# Altium project 2021-10-03-First_PCB_Project.PrjPcb
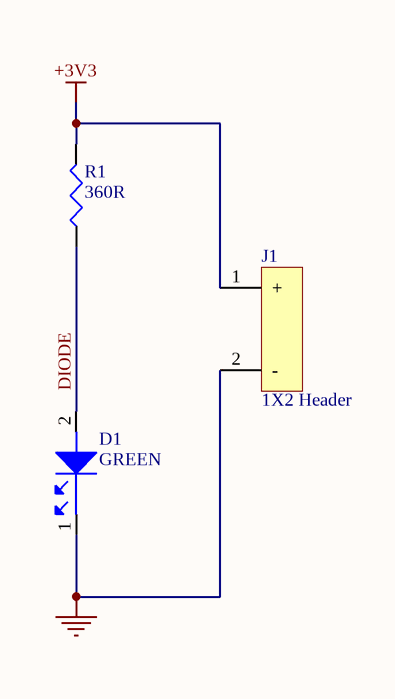
[diagram p0: Sheet1.SchDoc]
1 sheet, 3 parts. Net scope: global (net labels, ports and power ports of the same name join across sheets).
Board file: PCB1.PcbDoc

## Sheet Sheet1.SchDoc
size A4; SheetNumber: 1; SheetTotal: 1

### Parts
D1  GREEN  [LED0603_GREEN]
J1  1X2 Header  [HEADER 1X2]
R1  360R  [R0805]

### Nets
+3V3: J1.1(+) R1.2
GND: D1.1 J1.2(-)
DIODE: D1.2 R1.1

### Library data of the parts
D1 = LNJ337W83RA: LED GREEN ESS II SMD; Manufacturer: Panasonic SSG; Color: Green,Yellow; Luminous Intensity: 7.5mcd; Forward Voltage: 1.95V; Wavelength: 572nm; Forward Current: 20mA; Power Rating: 55mW; Test Current: 5mA; Lens Style: Rectangular; Number of LEDs: 1; Reverse Voltage: 4V; Supplier 1: Farnell; Supplier Part Number 1: 1908053; Manufacturer Part Number: LNJ337W83RA; RoHS: Yes; Category: Optoelectronics; Pricing 1: 5=0,17800, 25=0,15100, 100=0,11700, 250=0,10100, 500=0,09170, 1000=0,08240 (GBP); Mount: Surface Mount; Case/Package: 0603; Number of Pins: 2; Case Code (Metric): 1608; Case Code (Imperial): 0603; Min Operating Temperature: -30°C; Max Operating Temperature: 85°C; Package Quantity: 5000; Packaging: Cut Tape; Illumination Color: Green; Dominant Wavelength: 572nm; Max Power Dissipation: 55mW; Series: LN; Reverse Voltage (DC): 4V; Length: 1.6mm; Width: 0.8mm; Height: 0.2mm; REACH SVHC: Yes; Lead Free: Lead Free; RoHS Compliant: Yes; ComponentLink1URL: https://datasheet.ciiva.com/6868/lnj337w83ra-aek-6868817.pdf?src-supplier=Newark; ComponentLink1Description: https://datasheet.ciiva.com/6868/lnj337w83ra-aek-6868817.pdf?src-supplier=Newark; ComponentLink2URL: https://datasheet.ciiva.com/11775/0900766b80f0a8bb-11775418.pdf?src-supplier=RSComponents; ComponentLink2Description: https://datasheet.ciiva.com/11775/0900766b80f0a8bb-11775418.pdf?src-supplier=RSComponents; ComponentLink3URL: https://datasheet.ciiva.com/4690/lnj337w83ra-aek-226051-4690026.pdf?src-supplier=Mouser; ComponentLink3Description: https://datasheet.ciiva.com/4690/lnj337w83ra-aek-226051-4690026.pdf?src-supplier=Mouser
J1 = 22-29-2021: CONN HEADER VERT 2POS 2.54MM; Manufacturer: Molex; Number of Positions: 2; Connector Type: Header,Male Pin; Gender: Male; Voltage Rating (DC): 250V; Contact Post Length: 0.14inch; Glow Wire Compliant: Non-compliant; Supplier 1: Digi-Key; Manufacturer Part Number: 22-29-2021; RoHS: Yes; Category: Connectors; Stock 1: 9231; Pricing 1: 1=0,48000, 10=0,40400, 100=0,31400, 1000=0,24671, 5000=0,21680, 10000=0,20185 (USD); Mount: Through Hole; Housing Color: Natural; Color: White; Contact Plating: Gold; Contact Material: Tin; Contact Shape: Square; Insulation Material: Nylon; Insulation Color: Natural; Max Operating Temperature: 80°C; Number of Rows: 1; Packaging: Bulk; Termination: Through Hole; Series: 6410; Contact Type: -; Package Quantity: 24000; Fastening Type: Friction; Contact Mating Length: 0.295inch; Insulation Height: 0.461inch; Lead Free: Lead Free; Flammability Rating: UL94 V-0; Halogen Free: Low Halogen; ComponentLink1URL: https://datasheet.ciiva.com/70131/022292021-sd-70131706.pdf?src-supplier=Digi-Key; ComponentLink1Description: https://datasheet.ciiva.com/70131/022292021-sd-70131706.pdf?src-supplier=Digi-Key; Supplier Part Number 1: WM2744-ND
R1 = CRCW0805360RFKEA: Res Thick Film 0805 360 Ohm 1% 0.125W(1/8W) ±100ppm/C Molded SMD Automotive Paper T/R; Manufacturer: Vishay; Number of Terminals/Pins: 2; Temperature Coefficient: 100ppm/°C; Max Power Dissipation: 125mW; Voltage Rating (DC): 150V; Supplier 1: Digi-Key; Supplier Part Number 1: 541-360CCT-ND; Manufacturer Part Number: CRCW0805360RFKEA; RoHS: Yes; Category: Resistors; Stock 1: 14542; Pricing 1: 1=0,10000, 10=0,06700, 100=0,02710, 1000=0,01219, 2500=0,01058 (USD); Case/Package: 0805; Number of Pins: 2; Case Code (Metric): 2012; Case Code (Imperial): 0805; Contact Plating: Tin; Weight: 0.000194oz; Min Operating Temperature: -55°C; Max Operating Temperature: 155°C; Resistance: 360R; Tolerance: 1%; Packaging: Cut Tape; Resistor Type: Thick Film; Package Quantity: 5000; Number of Terminations: 2; Features: Automotive AEC-Q200; Series: D/CRCW E3; Power Rating: 125mW; Voltage Rating: 150V; Termination: SMD/SMT; Technology: THICK FILM; Length: 2mm; Width: 1.25mm; Height: 0.45mm; Depth: 1.25mm; Radiation Hardening: No; Lead Free: Lead Free; RoHS Compliant: Yes; REACH SVHC: Unknown; Military Standard: Not; ComponentLink1URL: https://datasheet.ciiva.com/2467/dcrcwe3-2467773.pdf?src-supplier=Digi-Key; ComponentLink1Description: https://datasheet.ciiva.com/2467/dcrcwe3-2467773.pdf?src-supplier=Digi-Key